# Altium schematic sheet rx_path_lp_filter.SchDoc: WULPUS PRO
size A4; DrawnBy: Sergei Vostrikov; Organization: Integrated Systems Laboratory; Revision: 1.0.0; SheetNumber: 4; SheetTotal: 8
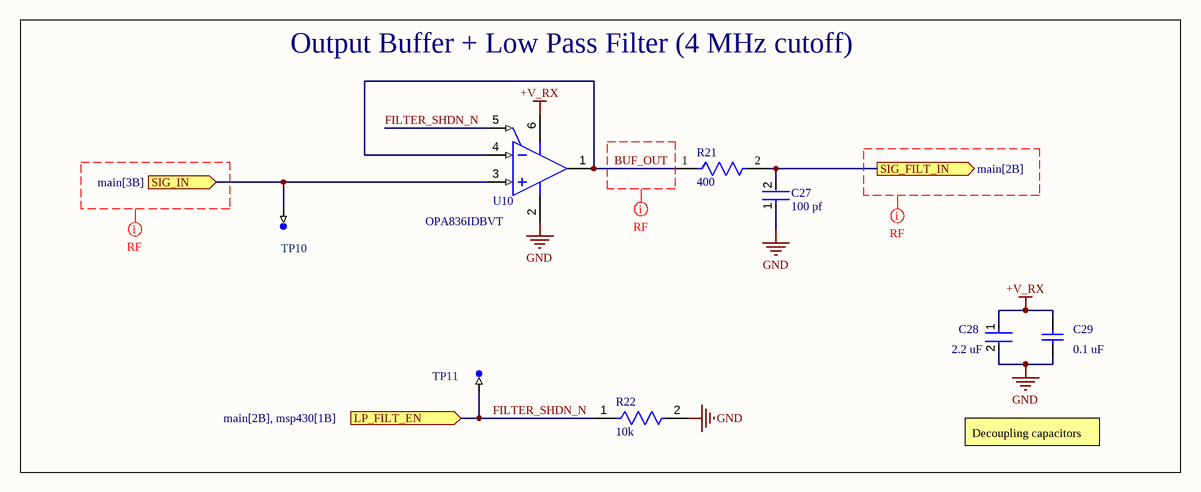
[diagram p0: rx_path_lp_filter.SchDoc]

## Parts
C27  100 pf  [FP-0402-L_1_0_1-W_0_5_0_1-MFG]
C28  2.2 uF  [FP-C1005-050-0_15-0_1-MFG]
C29  0.1 uF  [CAPC1005X55X30LL05T10]
R21  400  [FP-CRCW0402-C-e3-MFG]
R22  10k  [FP-CRCW0402-e3-IPC_B]
TP10  TP-SM-C-100  [TP-SM-C-100]  (value not drawn)  (no BOM)
TP11  TP-SM-C-100  [TP-SM-C-100]  (value not drawn)  (no BOM)
U10  OPA836IDBVT  [DBV0006A_L]

## Blocks framed on the sheet
Output Buffer + Low Pass Filter (4 MHz cutoff): C27-C29 R21 R22 TP10 TP11 U10

## Ports
LP_FILT_EN (in, see main[2B], msp430[1B]), SIG_FILT_IN (out, see main[2B]), SIG_IN (in, see main[3B])

## Nets
+V_RX: C28.1 C29.2 U10.6(VS+)
GND: C27.1 C28.2 C29.1 R22.2 U10.2(VS-)
BUF_OUT: R21.1 U10.1(VOUT) U10.4(VIN-)
FILTER_SHDN_N: R22.1 TP11.1 U10.5(~{PD}) ; port LP_FILT_EN
SIG_FILT_IN: C27.2 R21.2 ; port SIG_FILT_IN
SIG_IN: TP10.1 U10.3(VIN+) ; port SIG_IN

## Layout directives
net class RF: (no net found under the mark), BUF_OUT

## Notes on the sheet
- Decoupling capacitors
- 1
- 2
- 3
- 4
- A
- B
- C
- Project:
- D
- Date:
- Drawing number:
- Rev:
- Format:
- A4 Q
- Drawn by:
- Laboratory:
- Page
- Sheet:
- of
- File:

## Library data of the parts
C27 = CMP-2008-02567-2: 04025A101FAT2A; Dielectric: C0G; Capacitance: 100pF; Voltage: 50V; Tolerance: 1%; Dielectric Material: Ceramic; Packaging: Tape and Reel; Thickness: 0.022inch; Termination: SMD/SMT; Case Code (Imperial): 0402; Case Code (Metric): 1005; Width: 0.02inch; Radiation Hardening: No; Min Operating Temperature: -55°C; Depth: 0.5mm; Number of Pins: 2; Height: 0.56mm; REACH SVHC: No SVHC; Case/Package: 0402; Voltage Rating: 50V; Length: 1mm; Mount: Surface Mount; Max Operating Temperature: 125°C; Package Quantity: 1; Lead Free: Lead Free; Voltage Rating (DC): 50V
C28 = CMP-08246-004344-1: C1005X7S1A225K050BC; Capacitance: 2.2uF; Dielectric: X7S; Dielectric Material: Ceramic; Voltage Rating: 10V; Tolerance: 10%; Mount: Surface Mount; Height: 0.5mm; Package Quantity: 1; Depth: 0.5mm; RoHS Compliant: Yes; Length: 1mm; Thickness: 0.022inch; Packaging: Tape and Reel; Case Code (Imperial): 0402; Resistor Type: Ceramic; Case/Package: 0402; Min Operating Temperature: -55°C; Series: C; Weight: 2.3E-05oz; Width: 0.02inch; Voltage Rating (DC): 10V; Case Code (Metric): 1005; Max Operating Temperature: 125°C; Termination: SMD/SMT; Lead Free: Lead Free
C29 = CMP-0001-00074-2: C0402C104K4RACTU; Manufacturer: Kemet; Part Number: C0402C104K4RACTU
R21 = CMP-00030-23798141-1: CRCW04021R00FKEDC; Resistance: 1Ω; Tolerance: 1%; Temperature Coefficient: 100ppm/°C; Voltage Rating: 50V; Power Rating: 63mW; Lead Free: Lead Free; Case/Package: 0402; Max Operating Temperature: 155°C; RoHS: Compliant; Height: 350µm; Schedule B: 8533210045, 8533210045; Composition: Thick Film; NexarPartId: 23798141; Min Operating Temperature: -55°C
R22 = CMP-2002-08136-3: CRCW040210K0JNED; Temperature Coefficient: 200ppm/°C; Voltage Rating: 50V; Power Rating: 63mW; Resistance: 10kR; Tolerance: 5%; Military Standard: Not; Packaging: Tape and Reel; Case Code (Imperial): 0402; Min Operating Temperature: -55°C; Case Code (Metric): 1005; Case/Package: 0402; Termination: SMD/SMT; Composition: Thick Film; Depth: 0.5mm; Number of Terminations: 2; Contact Plating: Tin; Height: 0.016inch; Width: 0.5mm; Max Operating Temperature: 155°C; Features: Automotive AEC-Q200; Length: 1mm; Radiation Hardening: No; Max Power Dissipation: 63mW; Mount: Surface Mount; Package Quantity: 1; Weight: 2.3E-05oz
TP10 TP11 = CMP-0484-00002-1: Test Point, Surface Mount, Circular, Pad Diameter 1 mm
U10 = CMP-0018-00480-2: Very Low Power, Rail to Rail Out, Negative Rail In, VFB Operational Amplifier, 2.5 to 5.5 V, -40 to 125 degC, 6-pin SOT23 (DBV6), Green (RoHS & no Sb/Br); Manufacturer: Texas Instruments; Iq per channel(Max)(mA): 1; Settling Time (0.1%)(Typ)(ns): 30; Vs(Min)(V): 2.5; Vio(Max)(mV): 0.4; 3rd Harmonic(dBc): 105; BW @ Acl(MHz): 205; Vs(Max)(V): 5.5; 2nd Harmonic(dBc): 85; Sub Family: Audio Operational Amplifier, High Output Current Amplifier (>=50mA), High Speed Amplifier (>=50MHz), Low Noise Amp (<=10nV/rtHz), Low Offset Voltage Amplifier (<=500uV), Low Supply Voltage Amplifier (<=2.7V); Vn at Flatband(Typ)(nV/rtHz): 4.6; Iib(Max)(nA): 1000; Slew Rate(Typ)(V/us): 560; Io(Typ)(mA): 50; Number of Channels: 1; Eco-Plan: Green (RoHS & no Sb/Br); PartNumber: OPA836IDBVT; ComponentLink3URL: http://www.ti.com/litv/pdf/mpds026h; ComponentLink3Description: Package Specification; @ MHz: 1; ComponentLink1Description: Manufacturer URL; ComponentLink2URL: http://www.ti.com/general/docs/lit/getliterature.tsp?genericPartNumber=OPA836&fileType=pdf; Acl, min stable gain(V/V): 1; PackageVersion: 4073253-5/K, 03/2006; PackageDescription: 6-Pin Plastic Small Outline, Body 1.6 x 2.9 mm, Pitch 0.95 mm; ComponentLink1URL: http://www.ti.com/; ComponentLink2Description: Datasheet; PackageReference: DBV0006A; Code_JEDEC: MO-178; DatasheetVersion: SLOS712D; Mounting Technology: Surface Mount